# Altium project 4lun_motherBoard_4layerDesign-DESKTOP-UQTL3SR.PrjPCB
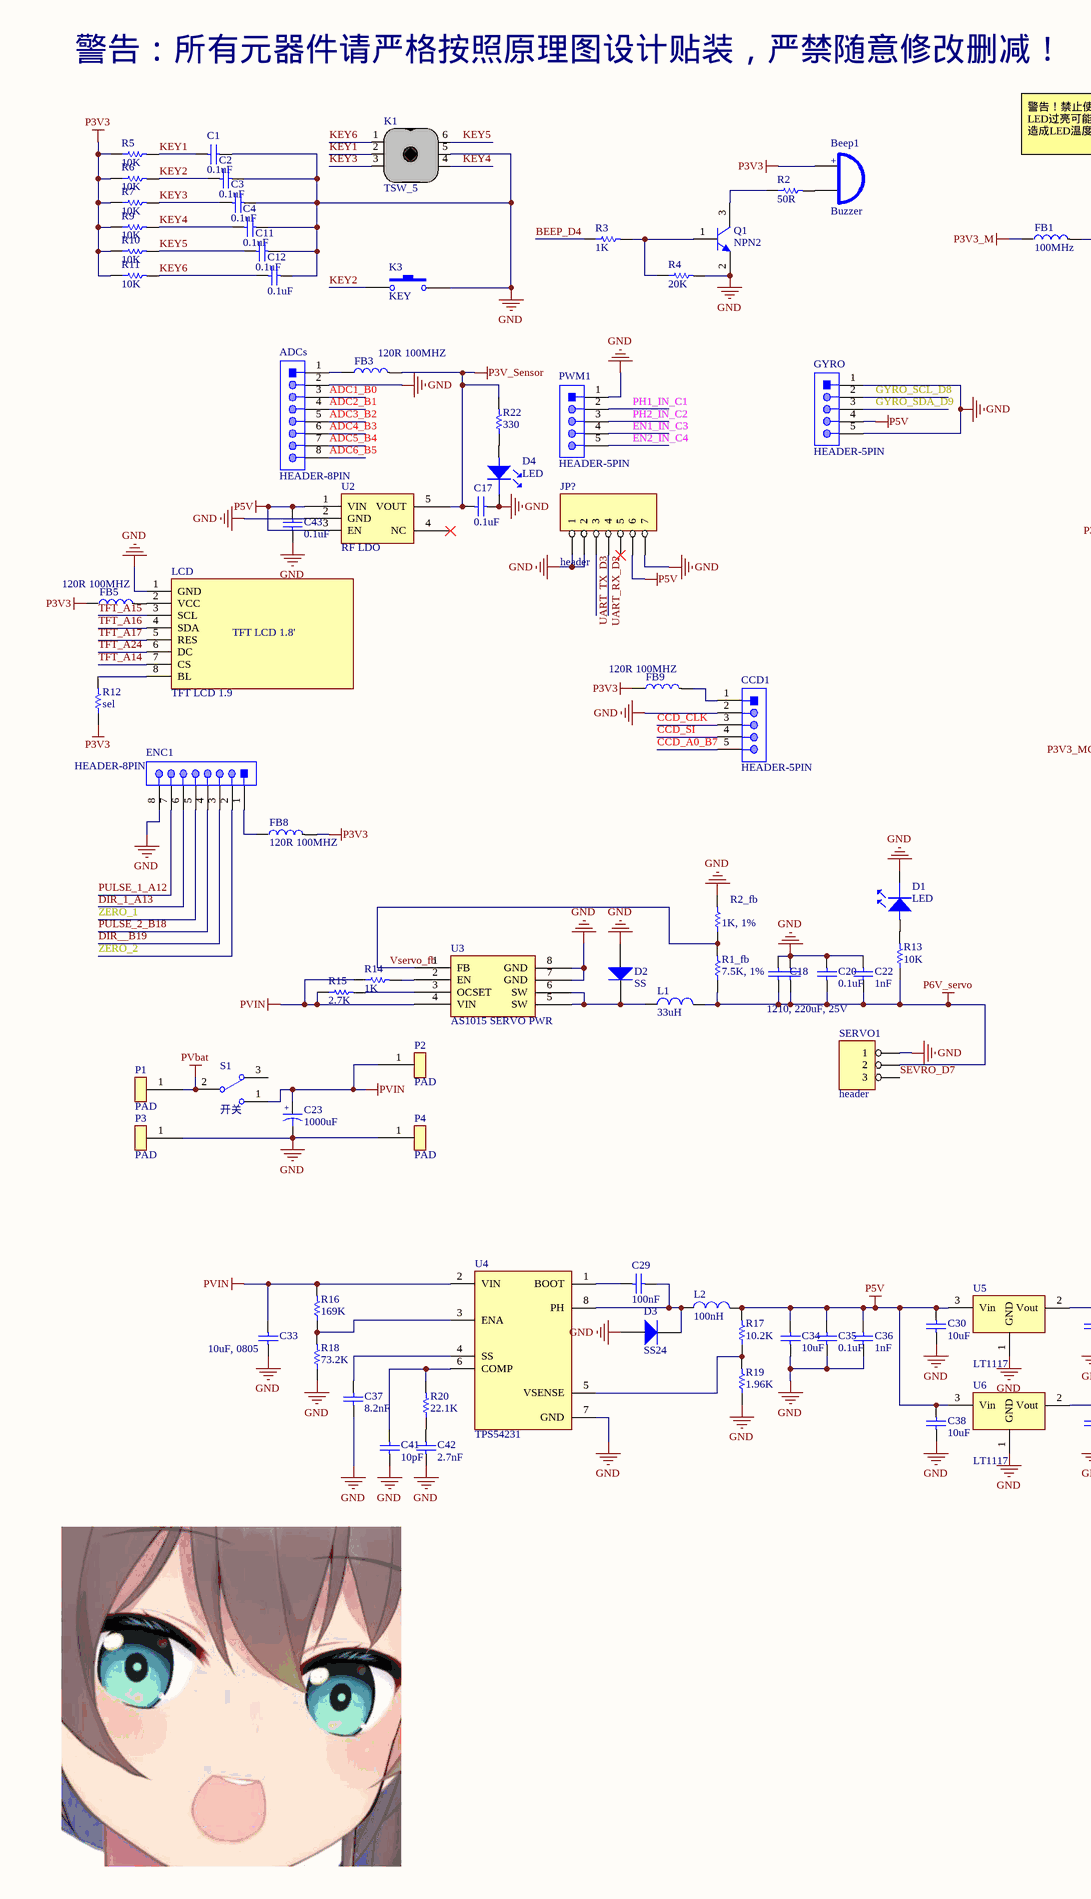
[diagram p0: MCU_main.SchDoc, left]
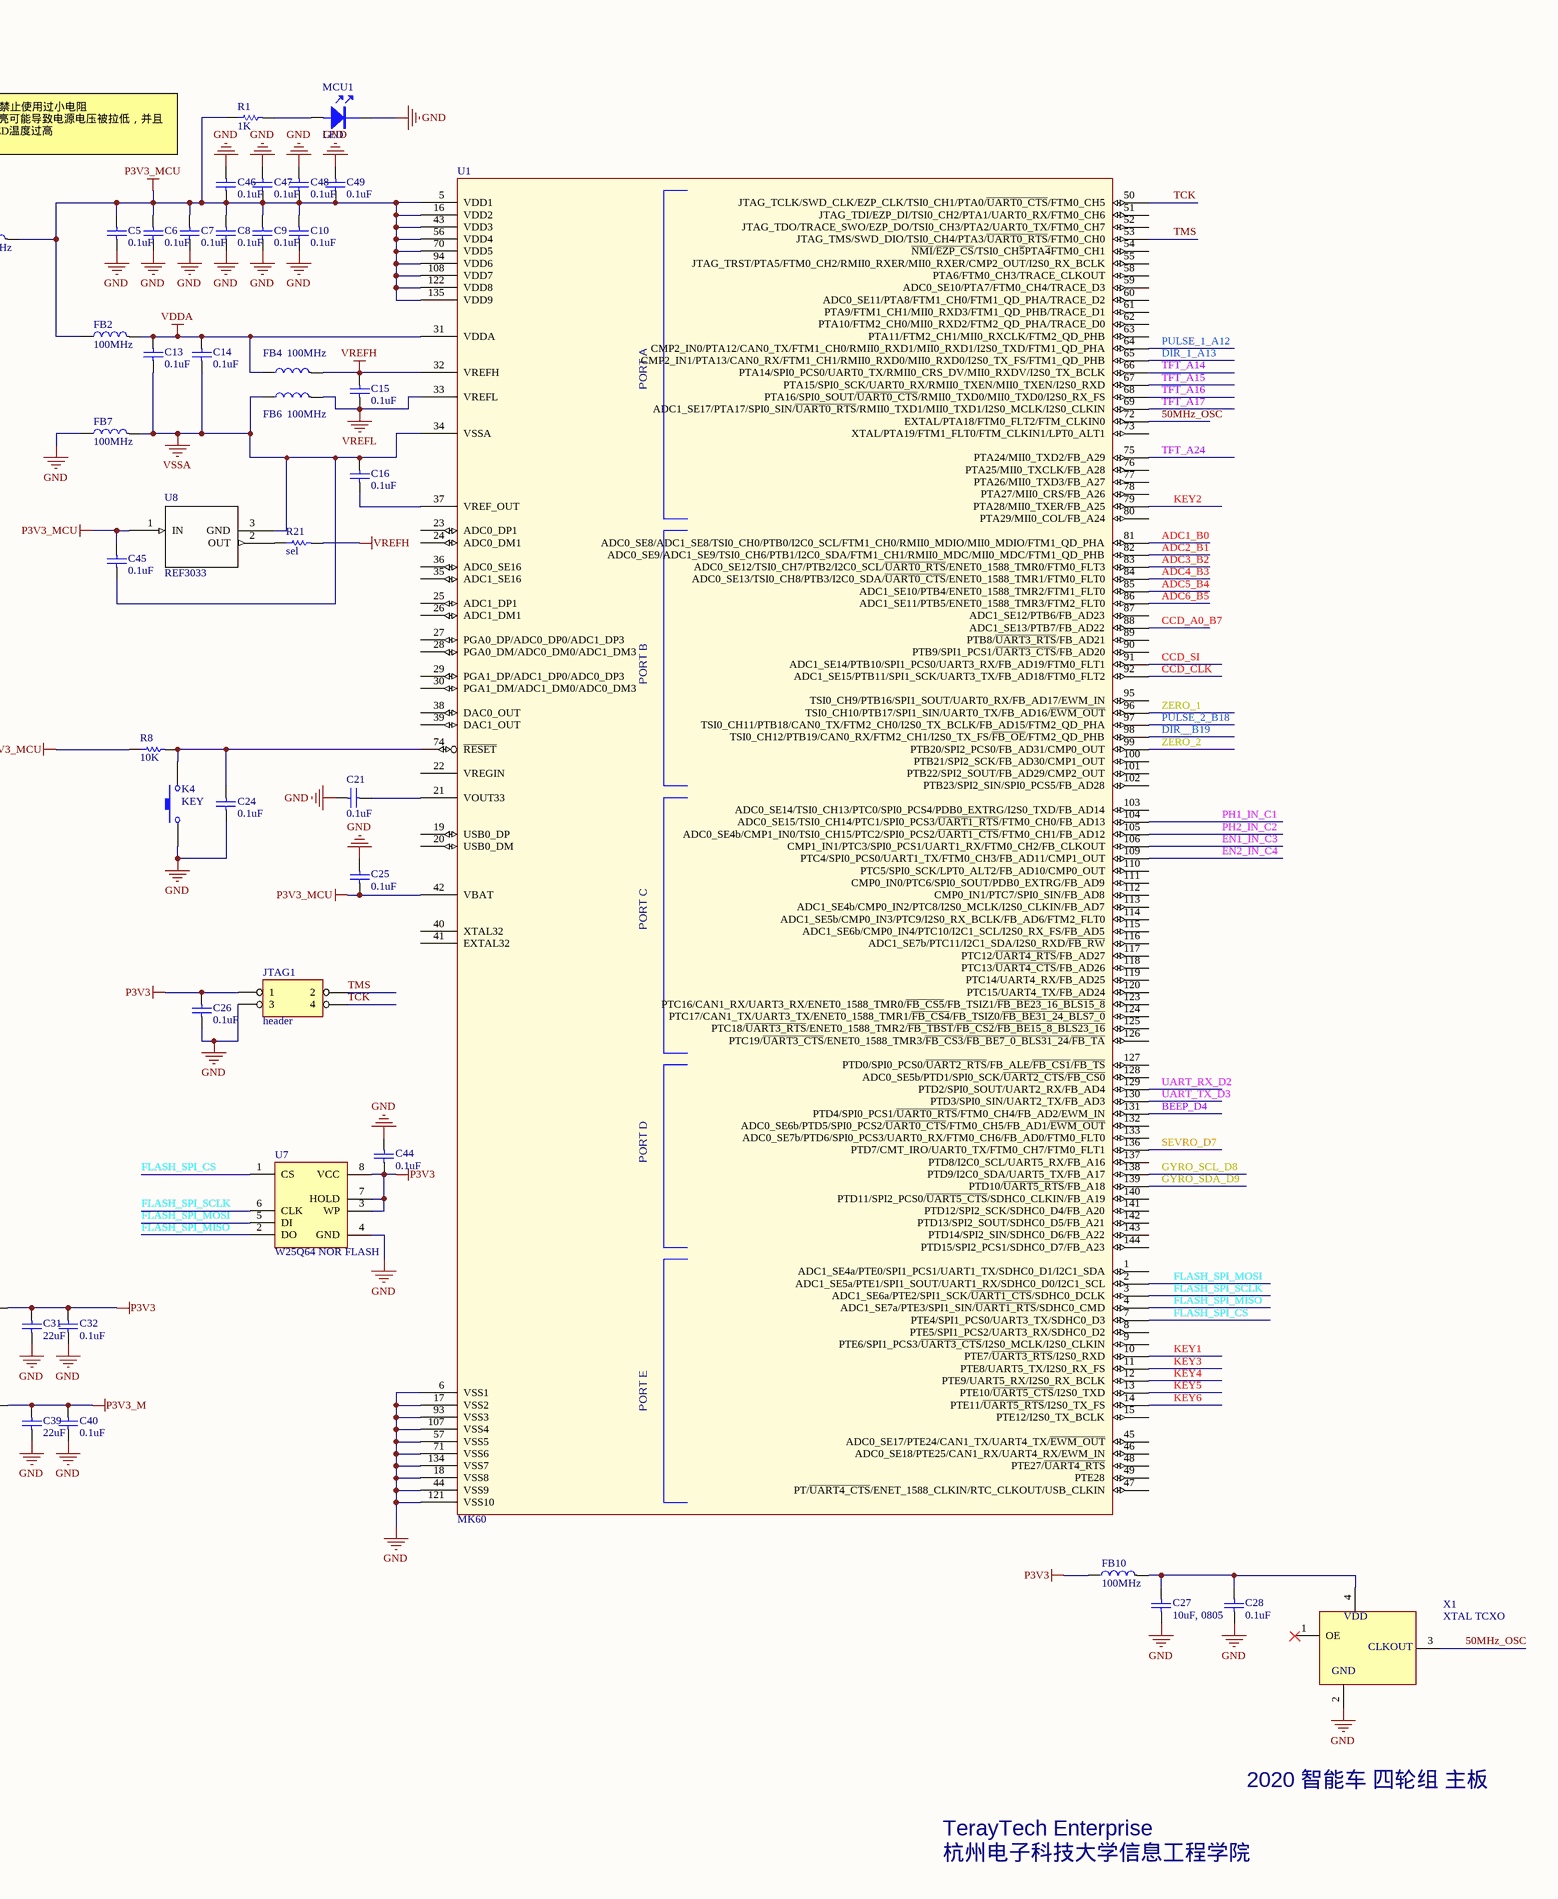
[diagram p1: MCU_main.SchDoc, right]
1 sheet, 118 parts. Net scope: global (net labels, ports and power ports of the same name join across sheets).
Board file: new_4lun_mb_mk66.PcbDoc

## Sheet MCU_main.SchDoc
size A2

### Parts
ADCs  HEADER-8PIN  [HEADER_8P_1.25_RT]
Beep1  Buzzer  [BUZZER_9.6*9.6*5mm]
C1  0.1uF  [0603_C]
C2  0.1uF  [0603_C]
C3  0.1uF  [0603_C]
C4  0.1uF  [0603_C]
C5  0.1uF  [0603_C]
C6  0.1uF  [0603_C]
C7  0.1uF  [0603_C]
C8  0.1uF  [0603_C]
C9  0.1uF  [0603_C]
C10  0.1uF  [0603_C]
C11  0.1uF  [0603_C]
C12  0.1uF  [0603_C]
C13  0.1uF  [0603_C]
C14  0.1uF  [0603_C]
C15  0.1uF  [0603_C]
C16  0.1uF  [0603_C]
C17  0.1uF  [0603_C]
C18  1210, 220uF, 25V  [C1210]
C19  1210, 220uF, 25V  [C1210]  (value not drawn)
C20  0.1uF  [0603_C]
C21  0.1uF  [0603_C]
C22  1nF  [0603_C]
C23  1000uF  [C10x16]
C24  0.1uF  [0603_C]
C25  0.1uF  [0603_C]
C26  0.1uF  [0603_C]
C27  10uF, 0805  [0805_c]
C28  0.1uF  [0603_C]
C29  100nF  [0603_C]
C30  10uF  [0805_c]
C31  22uF  [0805_c]
C32  0.1uF  [0603_C]
C33  10uF, 0805  [0805_c]
C34  10uF  [0805_c]
C35  0.1uF  [0603_C]
C36  1nF  [0603_C]
C37  8.2nF  [0603_C]
C38  10uF  [0805_c]
C39  22uF  [0805_c]
C40  0.1uF  [0603_C]
C41  10pF  [0603_C]
C42  2.7nF  [0603_C]
C43  0.1uF  [0603_C]
C44  0.1uF  [0603_C]
C45  0.1uF  [0603_C]
C46  0.1uF  [0603_C]
C47  0.1uF  [0603_C]
C48  0.1uF  [0603_C]
C49  0.1uF  [0603_C]
CCD1  HEADER-5PIN  [HEADER_5P_1.25_up]
D1  LED  [0603_LED]
D2  SS  [DO-214AC_G]
D3  SS24  [DO-214AC_G]
D4  LED  [0603_LED]
ENC1  HEADER-8PIN  [HEADER_8P_1.25_RT]
FB1  100MHz  [0805]
FB2  100MHz  [FB0603]
FB3  120R 100MHZ  [FB0603]
FB4  100MHz  [FB0603]
FB5  120R 100MHZ  [FB0603]
FB6  100MHz  [FB0603]
FB7  100MHz  [FB0603]
FB8  120R 100MHZ  [FB0603]
FB9  120R 100MHZ  [FB0603]
FB10  100MHz  [FB0603]
GYRO  HEADER-5PIN  [HEADER_5P_1.25_RT]
JP?  header  [header7]
JTAG1  header  [header2X2]
K1  TSW_5  [TSW-10]
K3  KEY  [贴片复位开关]
K4  KEY  [KEY_2]
L1  33uH  [L 5x5]
L2  100nH  [L 5x5]
LCD  TFT LCD 1.9  [header8 - lcd]
MCU1  LED  [0603_LED]
P1  PAD  [PAD_BIG]
P2  PAD  [PAD_BIG]
P3  PAD  [PAD_BIG]
P4  PAD  [PAD_BIG]
PWM1  HEADER-5PIN  [HEADER_5P_1.25_up]
Q1  NPN2  [SOT-23-3]
R1  1K  [0603_R]
R1_fb  7.5K, 1%  [0603_R]
R2  50R  [0603_R]
R2_fb  1K, 1%  [0603_R]
R3  1K  [0603_R]
R4  20K  [0603_R]
R5  10K  [0603_R]
R6  10K  [0603_R]
R7  10K  [0603_R]
R8  10K  [0603_R]
R9  10K  [0603_R]
R10  10K  [0603_R]
R11  10K  [0603_R]
R12  sel  [0603_R]
R13  10K  [0603_R]
R14  1K  [0603_R]
R15  2.7K  [0603_R]
R16  169K  [0603_R]
R17  10.2K  [0603_R]
R18  73.2K  [0603_R]
R19  1.96K  [0603_R]
R20  22.1K  [0603_R]
R21  sel  [0603_R]
R22  330  [0603_R]
S1  开关  [拨动开关]
SERVO1  header  [header3]
U1  MK60  [LQFP144]
U2  RF LDO  [SOT-23-5]
U3  AS1015 SERVO PWR  [SOIC-8]
U4  TPS54231  [SOIC-8]
U5  LT1117  [SOT-223]
U6  LT1117  [SOT-223]
U7  W25Q64 NOR FLASH  [SOIC8]
U8  REF3033  [DBZ3]
X1  XTAL TCXO  [OSC_KH3225_4P]

### Nets
GND: ADCs.2 C1.2 C2.2 C3.2 C4.2 C5.1 C6.1 C7.1 C8.1 C9.1 C10.1 C11.2 C12.2 C17.1 C18.2 C19.2 C20.2 C21.2 C22.2 C23.2 C24.2 C25.1 C26.2 C27.1 C28.1 C30.1 C31.1 C32.1 C33.1 C34.1 C35.1 C36.1 C37.1 C38.1 C39.1 C40.1 C41.1 C42.1 C43.2 C44.2 C46.1 C47.1 C48.1 C49.1 CCD1.2 D1.2(K) D2.1(A) D3.1(A) D4.2(K) ENC1.8 FB7.1 GYRO.1 GYRO.5 JP?.1 JP?.2 JP?.7 JTAG1.3 K1.5 K3.2 K4.1 LCD.1(GND) MCU1.2(K) P3.1 P4.1 PWM1.1 Q1.2(E) R2_fb.2 R4.2 R18.1 R19.1 SERVO1.1 U1.6(VSS1) U1.17(VSS2) U1.18(VSS8) U1.44(VSS9) U1.57(VSS5) U1.71(VSS6) U1.93(VSS3) U1.107(VSS4) U1.121(VSS10) U1.134(VSS7) U2.2(GND) U3.7(GND) U3.8(GND) U4.7(GND) U5.1(GND) U6.1(GND) U7.4(GND) X1.2(GND)
P3V3: Beep1.1(A) C26.1 C31.2 C32.2 C44.1 FB5.1 FB8.2 FB9.1 FB10.1 JTAG1.1 R5.1 R6.1 R7.1 R9.1 R10.1 R11.1 R12.1 U5.2(Vout) U7.3(WP) U7.7(HOLD) U7.8(VCC)
P3V3_M: C39.2 C40.2 FB1.1 U6.2(Vout)
P3V3_MCU: C5.2 C6.2 C7.2 C8.2 C9.2 C10.2 C25.2 C45.2 C46.2 C47.2 C48.2 C49.2 FB1.2 FB2.1 R1.1 R8.1 U1.5(VDD1) U1.16(VDD2) U1.42(VBAT) U1.43(VDD3) U1.56(VDD4) U1.70(VDD5) U1.94(VDD6) U1.108(VDD7) U1.122(VDD8) U1.135(VDD9) U8.1(IN)
P3V_Sensor: C17.2 FB3.2 R22.2 U2.5(VOUT)
P5V: C30.2 C34.2 C35.2 C36.2 C38.2 C43.1 GYRO.4 JP?.6 L2.2 R17.2 U2.1(VIN) U2.3(EN) U5.3(Vin) U6.3(Vin)
P6V_servo: C18.1 C19.1 C20.1 C22.1 L1.2 R1_fb.1 R13.1 SERVO1.2
PVbat: P1.1 S1.2
PVIN: C23.1 C33.2 P2.1 R14.1 R15.1 R16.2 S1.1 U3.4(VIN) U4.2(VIN)
VDDA: C13.2 C14.2 FB2.2 FB4.1 U1.31(VDDA)
VREFH: C15.2 FB4.2 R21.2 U1.32(VREFH)
VREFL: C15.1 FB6.2 U1.33(VREFL)
VSSA: C13.1 C14.1 C16.2 C45.1 FB6.1 FB7.2 U1.34(VSSA) U8.3(GND)
50MHz_OSC: U1.72(EXTAL/PTA18/FTM0_FLT2/FTM_CLKIN0) X1.3(CLK_OUT)
ADC1_B0: ADCs.3 U1.81(ADC0_SE8/ADC1_SE8/TSI0_CH0/PTB0/I2C0_SCL/FTM1_CH0/RMII0_MDIO/MII0_MDIO/FTM1_QD_PHA)
ADC2_B1: ADCs.4 U1.82(ADC0_SE9/ADC1_SE9/TSI0_CH6/PTB1/I2C0_SDA/FTM1_CH1/RMII0_MDC/MII0_MDC/FTM1_QD_PHB)
ADC3_B2: ADCs.5 U1.83(ADC0_SE12/TSI0_CH7/PTB2/I2C0_SCL/~{UART0_RTS}/ENET0_1588_TMR0/FTM0_FLT3)
ADC4_B3: ADCs.6 U1.84(ADC0_SE13/TSI0_CH8/PTB3/I2C0_SDA/~{UART0_CTS}/ENET0_1588_TMR1/FTM0_FLT0)
ADC5_B4: ADCs.7 U1.85(ADC1_SE10/PTB4/ENET0_1588_TMR2/FTM1_FLT0)
ADC6_B5: ADCs.8 U1.86(ADC1_SE11/PTB5/ENET0_1588_TMR3/FTM2_FLT0)
BEEP_D4: R3.1 U1.131(PTD4/SPI0_PCS1/~{UART0_RTS}/FTM0_CH4/FB_AD2/EWM_IN)
CCD_A0_B7: CCD1.5 U1.88(ADC1_SE13/PTB7/FB_AD22)
CCD_CLK: CCD1.3 U1.92(ADC1_SE15/PTB11/SPI1_SCK/UART3_TX/FB_AD18/FTM0_FLT2)
CCD_SI: CCD1.4 U1.91(ADC1_SE14/PTB10/SPI1_PCS0/UART3_RX/FB_AD19/FTM0_FLT1)
DIR_1_A13: ENC1.6 U1.65(CMP2_IN1/PTA13/CAN0_RX/FTM1_CH1/RMII0_RXD0/MII0_RXD0/I2S0_TX_FS/FTM1_QD_PHB)
DIR__B19: ENC1.3 U1.98(TSI0_CH12/PTB19/CAN0_RX/FTM2_CH1/I2S0_TX_FS/~{FB_OE}/FTM2_QD_PHB)
EN1_IN_C3: PWM1.4 U1.106(CMP1_IN1/PTC3/SPI0_PCS1/UART1_RX/FTM0_CH2/FB_CLKOUT)
EN2_IN_C4: PWM1.5 U1.109(PTC4/SPI0_PCS0/UART1_TX/FTM0_CH3/FB_AD11/CMP1_OUT)
FLASH_SPI_CS: U1.7(PTE4/SPI1_PCS0/UART3_TX/SDHC0_D3) U7.1(CS)
FLASH_SPI_MISO: U1.4(ADC1_SE7a/PTE3/SPI1_SIN/~{UART1_RTS}/SDHC0_CMD) U7.2(DO)
FLASH_SPI_MOSI: U1.2(ADC1_SE5a/PTE1/SPI1_SOUT/UART1_RX/SDHC0_D0/I2C1_SCL) U7.5(DI)
FLASH_SPI_SCLK: U1.3(ADC1_SE6a/PTE2/SPI1_SCK/~{UART1_CTS}/SDHC0_DCLK) U7.6(CLK)
GYRO_SCL_D8: GYRO.2 U1.138(PTD9/I2C0_SDA/UART5_TX/FB_A17)
GYRO_SDA_D9: GYRO.3 U1.139(PTD10/~{UART5_RTS}/FB_A18)
KEY1: C1.1 K1.2 R5.2 U1.10(PTE7/~{UART3_RTS}/I2S0_RXD)
KEY2: C2.1 K3.1 R6.2 U1.79(PTA28/MII0_TXER/FB_A25)
KEY3: C3.1 K1.3 R7.2 U1.11(PTE8/UART5_TX/I2S0_RX_FS)
KEY4: C4.1 K1.4 R9.2 U1.12(PTE9/UART5_RX/I2S0_RX_BCLK)
KEY5: C11.1 K1.6 R10.2 U1.13(PTE10/~{UART5_CTS}/I2S0_TXD)
KEY6: C12.1 K1.1 R11.2 U1.14(PTE11/~{UART5_RTS}/I2S0_TX_FS)
PH1_IN_C1: PWM1.2 U1.104(ADC0_SE15/TSI0_CH14/PTC1/SPI0_PCS3/~{UART1_RTS}/FTM0_CH0/FB_AD13)
PH2_IN_C2: PWM1.3 U1.105(ADC0_SE4b/CMP1_IN0/TSI0_CH15/PTC2/SPI0_PCS2/~{UART1_CTS}/FTM0_CH1/FB_AD12)
PULSE_1_A12: ENC1.7 U1.64(CMP2_IN0/PTA12/CAN0_TX/FTM1_CH0/RMII0_RXD1/MII0_RXD1/I2S0_TXD/FTM1_QD_PHA)
PULSE_2_B18: ENC1.4 U1.97(TSI0_CH11/PTB18/CAN0_TX/FTM2_CH0/I2S0_TX_BCLK/FB_AD15/FTM2_QD_PHA)
SEVRO_D7: SERVO1.3 U1.136(PTD7/CMT_IRO/UART0_TX/FTM0_CH7/FTM0_FLT1)
TCK: JTAG1.4 U1.50(JTAG_TCLK/SWD_CLK/EZP_CLK/TSI0_CH1/PTA0/~{UART0_CTS}/FTM0_CH5)
TFT_A14: LCD.7(CS) U1.66(PTA14/SPI0_PCS0/UART0_TX/RMII0_CRS_DV/MII0_RXDV/I2S0_TX_BCLK)
TFT_A15: LCD.3(SCL) U1.67(PTA15/SPI0_SCK/UART0_RX/RMII0_TXEN/MII0_TXEN/I2S0_RXD)
TFT_A16: LCD.4(SDA) U1.68(PTA16/SPI0_SOUT/~{UART0_CTS}/RMII0_TXD0/MII0_TXD0/I2S0_RX_FS)
TFT_A17: LCD.5(RES) U1.69(ADC1_SE17/PTA17/SPI0_SIN/~{UART0_RTS}/RMII0_TXD1/MII0_TXD1/I2S0_MCLK/I2S0_CLKIN)
TFT_A24: LCD.6(DC) U1.75(PTA24/MII0_TXD2/FB_A29)
TMS: JTAG1.2 U1.53(JTAG_TMS/SWD_DIO/TSI0_CH4/PTA3/~{UART0_RTS}/FTM0_CH0)
UART_RX_D2: JP?.4 U1.129(PTD2/SPI0_SOUT/UART2_RX/FB_AD4)
UART_TX_D3: JP?.3 U1.130(PTD3/SPI0_SIN/UART2_TX/FB_AD3)
Vservo_fb: R1_fb.2 R2_fb.1 U3.1(FB)
ZERO_1: ENC1.5 U1.96(TSI0_CH10/PTB17/SPI1_SIN/UART0_TX/FB_AD16/~{EWM_OUT})
ZERO_2: ENC1.2 U1.99(PTB20/SPI2_PCS0/FB_AD31/CMP0_OUT)
NetADCs_1: ADCs.1 FB3.1
NetBeep1_2: Beep1.2(B) R2.2
NetC16_1: C16.1 U1.37(VREF_OUT)
NetC21_1: C21.1 U1.21(VOUT33)
NetC24_1: C24.1 K4.2 R8.2 U1.74(~{RESET})
NetC27_2: C27.2 C28.2 FB10.2 X1.4(VDD)
NetC29_1: C29.1 D3.2(K) L2.1 U4.8(PH)
NetC29_2: C29.2 U4.1(BOOT)
NetC37_2: C37.2 U4.4(SS)
NetC41_2: C41.2 R20.2 U4.6(COMP)
NetC42_2: C42.2 R20.1
NetCCD1_1: CCD1.1 FB9.2
NetD1_1: D1.1(A) R13.2
NetD2_2: D2.2(K) L1.1 U3.5(SW) U3.6(SW)
NetD4_1: D4.1(A) R22.1
NetENC1_1: ENC1.1 FB8.1
NetFB5_2: FB5.2 LCD.2(VCC)
NetLCD_8: LCD.8(BL) R12.2
NetMCU1_1: MCU1.1(A) R1.2
NetQ1_1: Q1.1(B) R3.2 R4.1
NetQ1_3: Q1.3(C) R2.1
NetR14_2: R14.2 U3.2(EN)
NetR15_2: R15.2 U3.3(OCSET)
NetR16_1: R16.1 R18.2 U4.3(ENA)
NetR17_1: R17.1 R19.2 U4.5(VSENSE)
NetR21_1: R21.1 U8.2(OUT)

Not connected (* = marked no-connect by the designer): JP? 5*; S1 3; U1 1(ADC1_SE4a/PTE0/SPI1_PCS1/UART1_TX/SDHC0_D1/I2C1_SDA) 8(PTE5/SPI1_PCS2/UART3_RX/SDHC0_D2) 9(PTE6/SPI1_PCS3/~{UART3_CTS}/I2S0_MCLK/I2S0_CLKIN) 15(PTE12/I2S0_TX_BCLK) 19(USB0_DP) 20(USB0_DM) 22(VREGIN) 23(ADC0_DP1) 24(ADC0_DM1) 25(ADC1_DP1) 26(ADC1_DM1) 27(PGA0_DP/ADC0_DP0/ADC1_DP3) 28(PGA0_DM/ADC0_DM0/ADC1_DM3) 29(PGA1_DP/ADC1_DP0/ADC0_DP3) 30(PGA1_DM/ADC1_DM0/ADC0_DM3) 35(ADC1_SE16) 36(ADC0_SE16) 38(DAC0_OUT) 39(DAC1_OUT) 40(XTAL32) 41(EXTAL32) 45(ADC0_SE17/PTE24/CAN1_TX/UART4_TX/~{EWM_OUT}) 46(ADC0_SE18/PTE25/CAN1_RX/UART4_RX/EWM_IN) 47(PT/~{UART4_CTS}/ENET_1588_CLKIN/RTC_CLKOUT/USB_CLKIN) 48(PTE27/~{UART4_RTS}) 49(PTE28) 51(JTAG_TDI/EZP_DI/TSI0_CH2/PTA1/UART0_RX/FTM0_CH6) 52(JTAG_TDO/TRACE_SWO/EZP_DO/TSI0_CH3/PTA2/UART0_TX/FTM0_CH7) 54(~{NMI}/~{EZP_CS}/TSI0_CH~{5}PTA~{4}FTM0_CH1) 55(JTAG_TRST/PTA5/FTM0_CH2/RMII0_RXER/MII0_RXER/CMP2_OUT/I2S0_RX_BCLK) 58(PTA6/FTM0_CH3/TRACE_CLKOUT) 59(ADC0_SE10/PTA7/FTM0_CH4/TRACE_D3) 60(ADC0_SE11/PTA8/FTM1_CH0/FTM1_QD_PHA/TRACE_D2) 61(PTA9/FTM1_CH1/MII0_RXD3/FTM1_QD_PHB/TRACE_D1) 62(PTA10/FTM2_CH0/MII0_RXD2/FTM2_QD_PHA/TRACE_D0) 63(PTA11/FTM2_CH1/MII0_RXCLK/FTM2_QD_PHB) 73(XTAL/PTA19/FTM1_FLT0/FTM_CLKIN1/LPT0_ALT1) 76(PTA25/MII0_TXCLK/FB_A28) 77(PTA26/MII0_TXD3/FB_A27) 78(PTA27/MII0_CRS/FB_A26) 80(PTA29/MII0_COL/FB_A24) 87(ADC1_SE12/PTB6/FB_AD23) 89(PTB8/~{UART3_RTS}/FB_AD21) 90(PTB9/SPI1_PCS1/~{UART3_CTS}/FB_AD20) 95(TSI0_CH9/PTB16/SPI1_SOUT/UART0_RX/FB_AD17/EWM_IN) 100(PTB21/SPI2_SCK/FB_AD30/CMP1_OUT) 101(PTB22/SPI2_SOUT/FB_AD29/CMP2_OUT) 102(PTB23/SPI2_SIN/SPI0_PCS5/FB_AD28) 103(ADC0_SE14/TSI0_CH13/PTC0/SPI0_PCS4/PDB0_EXTRG/I2S0_TXD/FB_AD14) 110(PTC5/SPI0_SCK/LPT0_ALT2/FB_AD10/CMP0_OUT) 111(CMP0_IN0/PTC6/SPI0_SOUT/PDB0_EXTRG/FB_AD9) 112(CMP0_IN1/PTC7/SPI0_SIN/FB_AD8) 113(ADC1_SE4b/CMP0_IN2/PTC8/I2S0_MCLK/I2S0_CLKIN/FB_AD7) 114(ADC1_SE5b/CMP0_IN3/PTC9/I2S0_RX_BCLK/FB_AD6/FTM2_FLT0) 115(ADC1_SE6b/CMP0_IN4/PTC10/I2C1_SCL/I2S0_RX_FS/FB_AD5) 116(ADC1_SE7b/PTC11/I2C1_SDA/I2S0_RXD/~{FB_RW}) 117(PTC12/~{UART4_RTS}/FB_AD27) 118(PTC13/~{UART4_CTS}/FB_AD26) 119(PTC14/UART4_RX/FB_AD25) 120(PTC15/UART4_TX/FB_AD24) 123(PTC16/CAN1_RX/UART3_RX/ENET0_1588_TMR0/~{FB_CS5}/FB_TSIZ1/~{FB_BE23_16_BLS15_8}) 124(PTC17/CAN1_TX/UART3_TX/ENET0_1588_TMR1/~{FB_CS4}/FB_TSIZ0/~{FB_BE31_24_BLS7_0}) 125(PTC18/~{UART3_RTS}/ENET0_1588_TMR2/~{FB_TBST}/~{FB_CS2}/~{FB_BE15_8_BLS23_16}) 126(PTC19/~{UART3_CTS}/ENET0_1588_TMR3/~{FB_CS3}/~{FB_BE7_0_BLS31_24}/~{FB_TA}) 127(PTD0/SPI0_PCS0/~{UART2_RTS}/FB_ALE/~{FB_CS1}/~{FB_TS}) 128(ADC0_SE5b/PTD1/SPI0_SCK/~{UART2_CTS}/~{FB_CS0}) 132(ADC0_SE6b/PTD5/SPI0_PCS2/~{UART0_CTS}/FTM0_CH5/FB_AD1/~{EWM_OUT}) 133(ADC0_SE7b/PTD6/SPI0_PCS3/UART0_RX/FTM0_CH6/FB_AD0/FTM0_FLT0) 137(PTD8/I2C0_SCL/UART5_RX/FB_A16) 140(PTD11/SPI2_PCS0/~{UART5_CTS}/SDHC0_CLKIN/FB_A19) 141(PTD12/SPI2_SCK/SDHC0_D4/FB_A20) 142(PTD13/SPI2_SOUT/SDHC0_D5/FB_A21) 143(PTD14/SPI2_SIN/SDHC0_D6/FB_A22) 144(PTD15/SPI2_PCS1/SDHC0_D7/FB_A23); U2 4(NC)*; X1 1(OE)*

### Notes on the sheet
- 警告：所有元器件请严格按照原理图设计贴装，严禁随意修改删减！
- 警告！禁止使用过小电阻
  LED过亮可能导致电源电压被拉低，并且造成LED温度过高
- 2020 智能车 四轮组 主板
- 杭州电子科技大学信息工程学院
- TerayTech Enterprise
- (in symbol Buzzer) +
- (in symbol CAP1) +
- (in symbol MK60) PORT A; PORT B; PORT C; PORT D; PORT E
- (in symbol TFT LCD 1.9) TFT LCD 1.8'
- (in symbol xtal_tcxo) CLKOUT

### Library data of the parts
C1-C22 C24-C49 = CAP: Capacitor; Value: 104; Published: 8-Jun-2000; LatestRevisionDate: 17-Jul-2002; LatestRevisionNote: Re-released for DXP Platform.; PackageReference: RAD-0.3; Publisher: Altium Limited
C23 = CAP1
D1 D4 MCU1 = LED: LED 发光二极管
D2 = SS24
FB1 FB2 FB4 FB6 FB7 FB10 = FB: 磁珠
FB3 FB5 FB8 FB9 = FB: 120OHM@100MHZ 2A 25% 0603
JP? = HEADER 7
JTAG1 = HEADER 2X2
K1 = TSW_5: 方向开关
K3 K4 = KEY_2: Switch; Published: 24-Mar-1999; LatestRevisionDate: 17-Jul-2002; LatestRevisionNote: Re-released for DXP Platform.; PackageReference: SPST-2; Publisher: Altium Limited
L1 L2 = Inductor
Q1 = NPN2: 贴片
R1 R3 = RES: Resistor; Published: 8-Jun-2000; Revision: July-2002: Re-released for DXP Platform.; Publisher: Altium Limited; Value: 1K
R1_fb R2 R5-R13 R15-R22 = RES0: Resistor; Value: 1K; Published: 8-Jun-2000; Revision: July-2002: Re-released for DXP Platform.; Publisher: Altium Limited
R2_fb R14 = RES0: Resistor; Published: 8-Jun-2000; Revision: July-2002: Re-released for DXP Platform.; Publisher: Altium Limited; Value: 1K
R4 = RES: Resistor; Value: 1K; Published: 8-Jun-2000; Revision: July-2002: Re-released for DXP Platform.; Publisher: Altium Limited
S1 = switch 3
SERVO1 = HEADER 3
U2 = ADP150
U3 = AS1015
U5 U6 = AMS1117: 3.3V电压转换器AMS1117
U7 = w25qxx
U8 = REF3033_DBZ_3: Imported; Manufacturer: Texas Instruments; INDUSTRY_STD_PKG_TYPE: SOT-23; FAMILY_NAME: SERIES VOLTAGE REFERENCE; PIN_COUNT: 3; PACKAGE_DESIGNATOR: DBZ; Datasheet URL: http://www.ti.com/lit/gpn/REF3033; GENERIC_PART_NUMBER: REF3033; Vendor: Texas Instruments; Manufacturer_Part_Number: ref3033_dbz_3; RefDes: RefDes; Type: DEV; Value: Value
X1 = xtal_tcxo